# EasyEDA schematic 1-Schematic_New Project.json
TITLE: Sheet_1; REV: 1.0; Date: 2023-05-10; Sheet: 1/1; Drawn By: nikitosdanilov; Company: Your Company
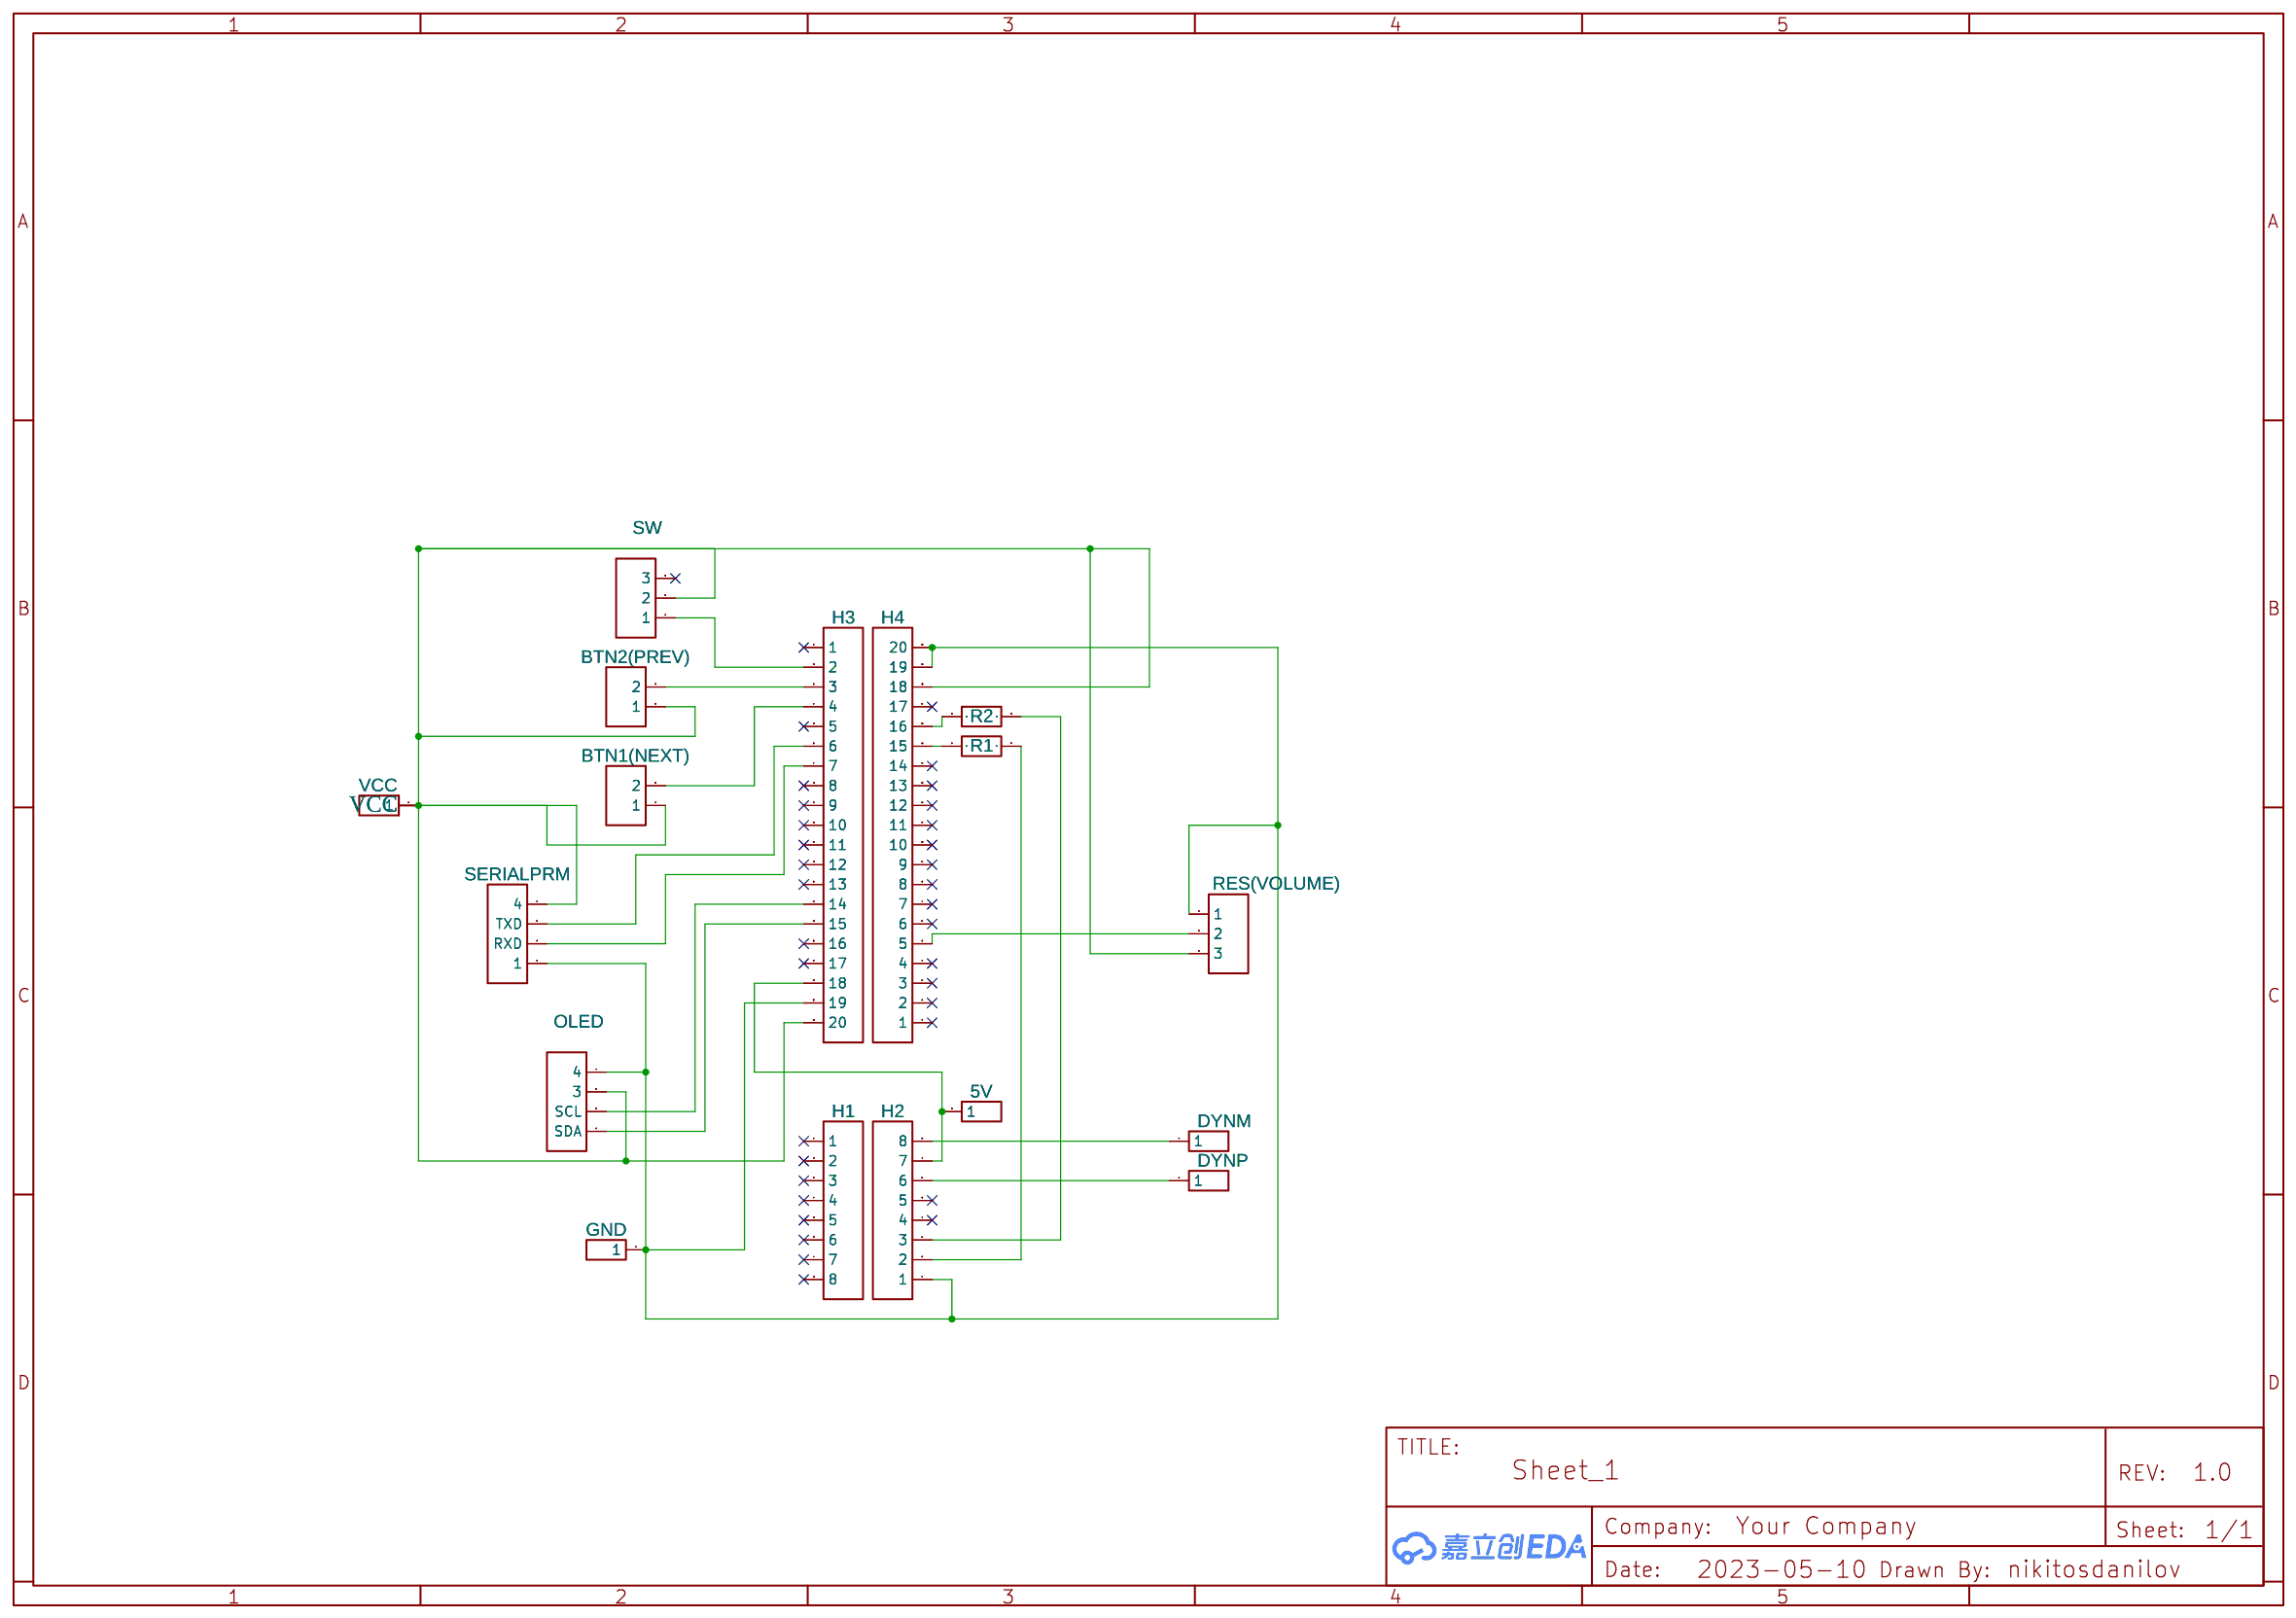
[diagram p0: schematic sheet]

## Parts
5V  5V  [HDR-M-2.54_1X1]
BTN1(NEXT)  HDR-F-2.54_1x2  [HDR-F-2.54_1X2]
BTN2(PREV)  HDR-F-2.54_1x2  [HDR-F-2.54_1X2]
DYNM  5V  [HDR-M-2.54_1X1]
DYNP  5V  [HDR-M-2.54_1X1]
GND  5V  [HDR-M-2.54_1X1]
H1  HDR-F-2.54_1x8  [HDR-F-2.54_1X8]
H2  HDR-F-2.54_1x8  [HDR-F-2.54_1X8]
H3  HDR-F-2.54_1x20  [HDR-F-2.54_1X20]
H4  HDR-F-2.54_1x20  [HDR-F-2.54_1X20]
OLED  HDR-F-2.54_1x4  [HDR-F-2.54_1X4]
R1  1k  [R_AXIAL-0.4]
R2  1k  [R_AXIAL-0.4]
RES(VOLUME)  HDR-F-2.54_1x3  [HDR-F-2.54_1X3]
SERIALPRM  HDR-F-2.54_1x4  [HDR-F-2.54_1X4]
SW  HDR-F-2.54_1x3  [HDR-F-2.54_1X3]
VCC  5V  [HDR-M-2.54_1X1]

## Library data of the parts
5V DYNM DYNP GND VCC = HDR-M-2.54_1x1: Supplier Part: C81276; Supplier: LCSC; Contributor: LCEDA_Lib
BTN1(NEXT) BTN2(PREV) = HDR-F-2.54_1x2: Supplier Part: C49661; Supplier: LCSC; Contributor: LCEDA_Lib
H1 H2 = HDR-F-2.54_1x8: Supplier Part: C225505; Supplier: LCSC; Contributor: LCEDA_Lib
H3 H4 = HDR-F-2.54_1x20: Supplier Part: C50984; Supplier: LCSC; Contributor: LCEDA_Lib
OLED SERIALPRM = HDR-F-2.54_1x4: Supplier Part: C225501; Supplier: LCSC; Contributor: LCEDA_Lib
R1 R2 = R_AXIAL-0.4_EU: Contributor: LCEDA_Lib
RES(VOLUME) SW = HDR-F-2.54_1x3: Supplier Part: C146690; Supplier: LCSC; Contributor: LCEDA_Lib

## Nets
VCC: BTN1(NEXT).1 BTN2(PREV).1 H3.20 H4.18 OLED.3 RES(VOLUME).3 SERIALPRM.4 SW.2 VCC.1
Net-(5V-1): 5V.1 H2.7 H3.18
Net-(BTN1(NEXT)-2): BTN1(NEXT).2 H3.4
Net-(BTN2(PREV)-2): BTN2(PREV).2 H3.3
Net-(DYNM-1): DYNM.1 H2.8
Net-(DYNP-1): DYNP.1 H2.6
Net-(GND-1): GND.1 H2.1 H3.19 H4.19 H4.20 OLED.4 RES(VOLUME).1 SERIALPRM.1
Net-(H2-2): H2.2 R1.2
Net-(H2-3): H2.3 R2.2
Net-(H3-2): H3.2 SW.1
Net-(H3-6): H3.6 SERIALPRM.3(TXD)
Net-(H3-7): H3.7 SERIALPRM.2(RXD)
Net-(H3-14): H3.14 OLED.2(SCL)
Net-(H3-15): H3.15 OLED.1(SDA)
Net-(H4-5): H4.5 RES(VOLUME).2
Net-(H4-15): H4.15 R1.1
Net-(H4-16): H4.16 R2.1

Not connected (* = marked no-connect by the designer): H1 1* 2* 3* 4* 5* 6* 7* 8*; H2 4* 5*; H3 1* 5* 8* 9* 10* 11* 12* 13* 16* 17*; H4 1* 2* 3* 4* 6* 7* 8* 9* 10* 11* 12* 13* 14* 17*; SW 3*
